# Altium project Optical Digital Interface.PrjPcb
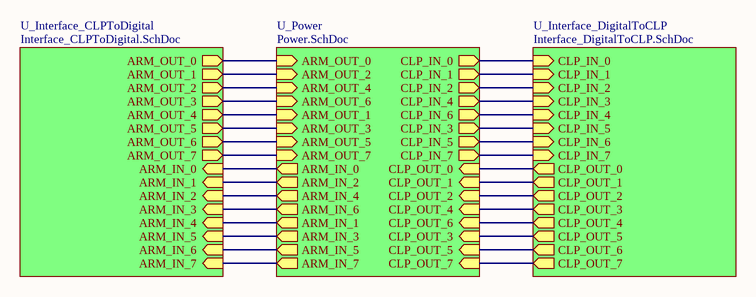
[diagram p0: Interface.SchDoc]
4 sheets, 108 parts. Net scope: hierarchical (ports join the sheet entries above them; power ports are global).
Board file: Interface.PcbDoc
Sheets:
  Interface.SchDoc
    U_Power = Power.SchDoc
    U_Interface_DigitalToCLP = Interface_DigitalToCLP.SchDoc
    U_Interface_CLPToDigital = Interface_CLPToDigital.SchDoc

## Sheet Interface.SchDoc
size A4

### Sub-sheets
U_Interface_CLPToDigital = Interface_CLPToDigital.SchDoc: ARM_IN_0 (in), ARM_IN_1 (in), ARM_IN_2 (in), ARM_IN_3 (in), ARM_IN_4 (in), ARM_IN_5 (in), ARM_IN_6 (in), ARM_IN_7 (in), ARM_OUT_0 (out), ARM_OUT_1 (out), ARM_OUT_2 (out), ARM_OUT_3 (out), ARM_OUT_4 (out), ARM_OUT_5 (out), ARM_OUT_6 (out), ARM_OUT_7 (out)
U_Interface_DigitalToCLP = Interface_DigitalToCLP.SchDoc: CLP_IN_0 (in), CLP_OUT_0 (out), CLP_IN_1 (in), CLP_OUT_1 (out), CLP_IN_2 (in), CLP_OUT_2 (out), CLP_IN_3 (in), CLP_OUT_3 (out), CLP_IN_4 (in), CLP_OUT_4 (out), CLP_IN_5 (in), CLP_OUT_5 (out), CLP_IN_6 (in), CLP_OUT_6 (out), CLP_IN_7 (in), CLP_OUT_7 (out)
U_Power = Power.SchDoc: CLP_IN_0 (out), CLP_IN_1 (out), CLP_IN_2 (out), CLP_IN_4 (out), CLP_IN_6 (out), CLP_IN_3 (out), CLP_IN_5 (out), CLP_IN_7 (out), CLP_OUT_0 (in), CLP_OUT_1 (in), CLP_OUT_2 (in), CLP_OUT_4 (in), CLP_OUT_6 (in), CLP_OUT_3 (in), CLP_OUT_5 (in), CLP_OUT_7 (in), ARM_IN_0 (out), ARM_OUT_0 (in), ARM_OUT_2 (in), ARM_OUT_4 (in), ARM_OUT_6 (in), ARM_OUT_1 (in), ARM_OUT_3 (in), ARM_OUT_5 (in), ARM_OUT_7 (in), ARM_IN_2 (out), ARM_IN_4 (out), ARM_IN_6 (out), ARM_IN_1 (out), ARM_IN_3 (out), ARM_IN_5 (out), ARM_IN_7 (out)

### Nets
NetCN1_1: sheet U_Power/CLP_IN_0, sheet U_Interface_DigitalToCLP/CLP_IN_0
NetCN1_2: sheet U_Power/CLP_IN_1, sheet U_Interface_DigitalToCLP/CLP_IN_1
NetCN1_3: sheet U_Power/CLP_IN_2, sheet U_Interface_DigitalToCLP/CLP_IN_2
NetCN1_4: sheet U_Power/CLP_IN_3, sheet U_Interface_DigitalToCLP/CLP_IN_5
NetCN1_5: sheet U_Power/CLP_IN_4, sheet U_Interface_DigitalToCLP/CLP_IN_3
NetCN1_6: sheet U_Power/CLP_IN_5, sheet U_Interface_DigitalToCLP/CLP_IN_6
NetCN1_7: sheet U_Power/CLP_IN_6, sheet U_Interface_DigitalToCLP/CLP_IN_4
NetCN1_8: sheet U_Power/CLP_IN_7, sheet U_Interface_DigitalToCLP/CLP_IN_7
NetCN3_1: sheet U_Power/ARM_OUT_0, sheet U_Interface_CLPToDigital/ARM_OUT_0
NetCN3_2: sheet U_Power/ARM_OUT_1, sheet U_Interface_CLPToDigital/ARM_OUT_4
NetCN3_3: sheet U_Power/ARM_OUT_2, sheet U_Interface_CLPToDigital/ARM_OUT_1
NetCN3_4: sheet U_Power/ARM_OUT_3, sheet U_Interface_CLPToDigital/ARM_OUT_5
NetCN3_5: sheet U_Power/ARM_OUT_4, sheet U_Interface_CLPToDigital/ARM_OUT_2
NetCN3_6: sheet U_Power/ARM_OUT_5, sheet U_Interface_CLPToDigital/ARM_OUT_6
NetCN3_7: sheet U_Power/ARM_OUT_6, sheet U_Interface_CLPToDigital/ARM_OUT_3
NetCN3_8: sheet U_Power/ARM_OUT_7, sheet U_Interface_CLPToDigital/ARM_OUT_7
NetCN4_1: sheet U_Power/CLP_OUT_0, sheet U_Interface_DigitalToCLP/CLP_OUT_0
NetCN4_2: sheet U_Power/CLP_OUT_1, sheet U_Interface_DigitalToCLP/CLP_OUT_1
NetCN4_3: sheet U_Power/CLP_OUT_2, sheet U_Interface_DigitalToCLP/CLP_OUT_2
NetCN4_4: sheet U_Power/CLP_OUT_3, sheet U_Interface_DigitalToCLP/CLP_OUT_5
NetCN4_5: sheet U_Power/CLP_OUT_4, sheet U_Interface_DigitalToCLP/CLP_OUT_3
NetCN4_6: sheet U_Power/CLP_OUT_5, sheet U_Interface_DigitalToCLP/CLP_OUT_6
NetCN4_7: sheet U_Power/CLP_OUT_6, sheet U_Interface_DigitalToCLP/CLP_OUT_4
NetCN4_8: sheet U_Power/CLP_OUT_7, sheet U_Interface_DigitalToCLP/CLP_OUT_7
NetCN6_1: sheet U_Power/ARM_IN_0, sheet U_Interface_CLPToDigital/ARM_IN_0
NetCN6_2: sheet U_Power/ARM_IN_1, sheet U_Interface_CLPToDigital/ARM_IN_4
NetCN6_3: sheet U_Power/ARM_IN_2, sheet U_Interface_CLPToDigital/ARM_IN_1
NetCN6_4: sheet U_Power/ARM_IN_3, sheet U_Interface_CLPToDigital/ARM_IN_5
NetCN6_5: sheet U_Power/ARM_IN_4, sheet U_Interface_CLPToDigital/ARM_IN_2
NetCN6_6: sheet U_Power/ARM_IN_5, sheet U_Interface_CLPToDigital/ARM_IN_6
NetCN6_7: sheet U_Power/ARM_IN_6, sheet U_Interface_CLPToDigital/ARM_IN_3
NetCN6_8: sheet U_Power/ARM_IN_7, sheet U_Interface_CLPToDigital/ARM_IN_7

## Sheet Power.SchDoc
size A4
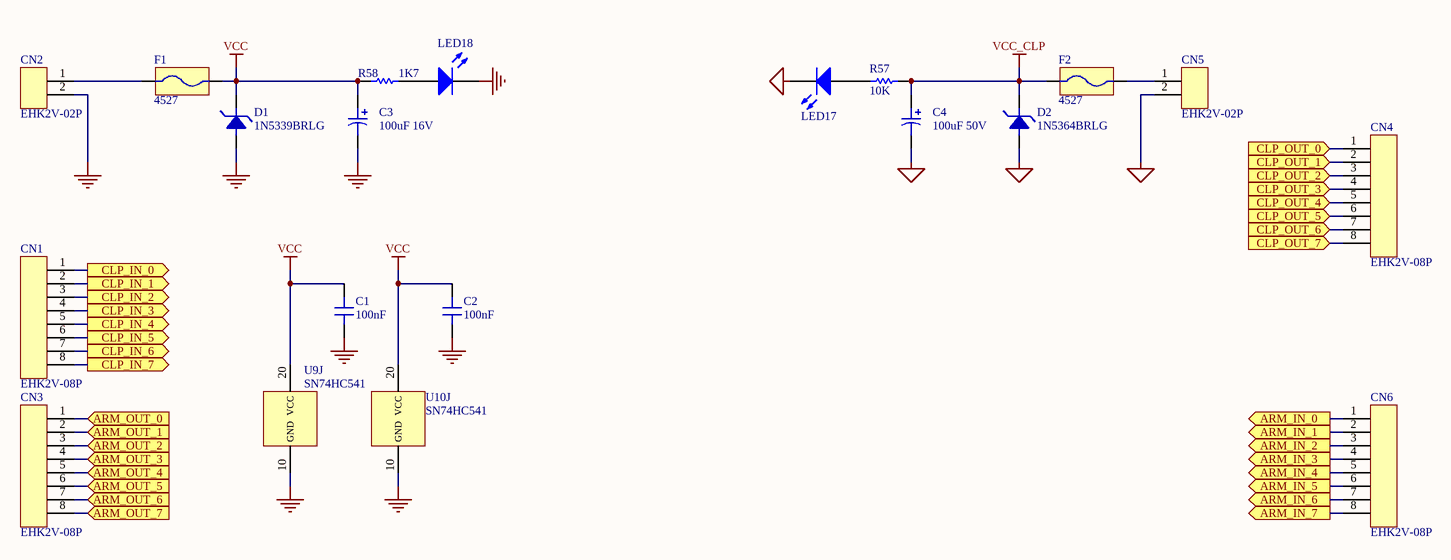
[diagram p1: Power.SchDoc]

### Parts
C1  100nF  [DiskCapacitor]
C2  100nF  [DiskCapacitor]
C3  100uF 16V  [ECA 5x11]
C4  100uF 50V  [ECA 8x11.5]
CN1  EHK2V-08P  [EHK2V-08P]
CN2  EHK2V-02P  [EHK2V-02P]
CN3  EHK2V-08P  [EHK2V-08P]
CN4  EHK2V-08P  [EHK2V-08P]
CN5  EHK2V-02P  [EHK2V-02P]
CN6  EHK2V-08P  [EHK2V-08P]
D1  1N5339BRLG  [DO-15]
D2  1N5364BRLG  [DO-15]
F1  4527  [4527]
F2  4527  [4527]
LED17  151053YS04500  [Type 5mm]  (value not drawn)
LED18  151053YS04500  [Type 5mm]  (value not drawn)
R57  value 10K  [AXIAL-0.3]  (hidden comment: Res1)
R58  value 1K7  [AXIAL-0.3]  (hidden comment: Res1)
U9  SN74HC541  [PDIP20]  (part J of 10)
U10  SN74HC541  [PDIP20]  (part J of 10)

### Ports
ARM_IN_0 (out), ARM_IN_1 (out), ARM_IN_2 (out), ARM_IN_3 (out), ARM_IN_4 (out), ARM_IN_5 (out), ARM_IN_6 (out), ARM_IN_7 (out), ARM_OUT_0 (in), ARM_OUT_1 (in), ARM_OUT_2 (in), ARM_OUT_3 (in), ARM_OUT_4 (in), ARM_OUT_5 (in), ARM_OUT_6 (in), ARM_OUT_7 (in), CLP_IN_0 (out), CLP_IN_1 (out), CLP_IN_2 (out), CLP_IN_3 (out), CLP_IN_4 (out), CLP_IN_5 (out), CLP_IN_6 (out), CLP_IN_7 (out), CLP_OUT_0 (in), CLP_OUT_1 (in), CLP_OUT_2 (in), CLP_OUT_3 (in), CLP_OUT_4 (in), CLP_OUT_5 (in), CLP_OUT_6 (in), CLP_OUT_7 (in)

### Nets
CLP_GND: C4.2 CN5.2 D2.2 LED17.1(K)
GND: C1.1 C2.1 C3.2 CN2.2 D1.2 LED18.1(K) U9.10(GND) U10.10(GND)
VCC: C1.2 C2.2 C3.1 D1.1 F1.2 R58.2 U9.20(VCC) U10.20(VCC)
VCC_CLP: C4.1 D2.1 F2.1 R57.2
NetCN1_1: CN1.1 ; port CLP_IN_0
NetCN1_2: CN1.2 ; port CLP_IN_1
NetCN1_3: CN1.3 ; port CLP_IN_2
NetCN1_4: CN1.4 ; port CLP_IN_3
NetCN1_5: CN1.5 ; port CLP_IN_4
NetCN1_6: CN1.6 ; port CLP_IN_5
NetCN1_7: CN1.7 ; port CLP_IN_6
NetCN1_8: CN1.8 ; port CLP_IN_7
NetCN2_1: CN2.1 F1.1
NetCN3_1: CN3.1 ; port ARM_OUT_0
NetCN3_2: CN3.2 ; port ARM_OUT_1
NetCN3_3: CN3.3 ; port ARM_OUT_2
NetCN3_4: CN3.4 ; port ARM_OUT_3
NetCN3_5: CN3.5 ; port ARM_OUT_4
NetCN3_6: CN3.6 ; port ARM_OUT_5
NetCN3_7: CN3.7 ; port ARM_OUT_6
NetCN3_8: CN3.8 ; port ARM_OUT_7
NetCN4_1: CN4.1 ; port CLP_OUT_0
NetCN4_2: CN4.2 ; port CLP_OUT_1
NetCN4_3: CN4.3 ; port CLP_OUT_2
NetCN4_4: CN4.4 ; port CLP_OUT_3
NetCN4_5: CN4.5 ; port CLP_OUT_4
NetCN4_6: CN4.6 ; port CLP_OUT_5
NetCN4_7: CN4.7 ; port CLP_OUT_6
NetCN4_8: CN4.8 ; port CLP_OUT_7
NetCN5_1: CN5.1 F2.2
NetCN6_1: CN6.1 ; port ARM_IN_0
NetCN6_2: CN6.2 ; port ARM_IN_1
NetCN6_3: CN6.3 ; port ARM_IN_2
NetCN6_4: CN6.4 ; port ARM_IN_3
NetCN6_5: CN6.5 ; port ARM_IN_4
NetCN6_6: CN6.6 ; port ARM_IN_5
NetCN6_7: CN6.7 ; port ARM_IN_6
NetCN6_8: CN6.8 ; port ARM_IN_7
NetLED17_2: LED17.2(A) R57.1
NetLED18_2: LED18.2(A) R58.1

### Library data of the parts
C1 C2 = Capacitor
C3 = ECA1CM101
C4 = ECA1HM101
CN1 CN3 CN4 CN6 = EHK2V-08P: PCB Terminal Blocks
CN2 CN5 = EHK2V-02P: PCB Terminal Blocks
D1 = Diode Zener: 5V6 @ 5W
D2 = Diode Zener: 33V @ 5W
F1 F2 = 4527: 5mm PC FUSE HOLDER
LED17 LED18 = CMP-1477-00001-1: THT LED round mono-color waterclear, WL-TMRW, Yellow; Manufacturer: Wuerth Elektronik; ComponentLink2URL: http://katalog.we-online.de/pbs/datasheet/7448042001.pdfhttp://katalog.we-online.de/pbs/datasheet/7448042001.pdfhttp://katalog.we-online.de/pbs/datasheet/7448042001.pdfhttp://katalog.we-online.de/pbs/datasheet/151053YS04500.pdf; Emitting color: Yellow; PackageReference: Type 5mm; ComponentLink1URL: http://www.we-online.com; PartNumber: 151053YS04500; ComponentLink2Description: Datasheet; ComponentLink1Description: Manufacturer URL
R57 R58 = Res1: Resistor; Published: 8-Jun-2000; LatestRevisionDate: 17-Jul-2002; LatestRevisionNote: Re-released for DXP Platform.; PackageReference: AXIAL-0.3; Publisher: Altium Limited; PackageDescription: Axial Device, Thru-Hole; 2 Leads; 0.3 in Pin Spacing
U9 U10 = SN74HC541: Octal Buffers and Line Drivers With 3-State Outputs

## Sheet Interface_DigitalToCLP.SchDoc
size A4
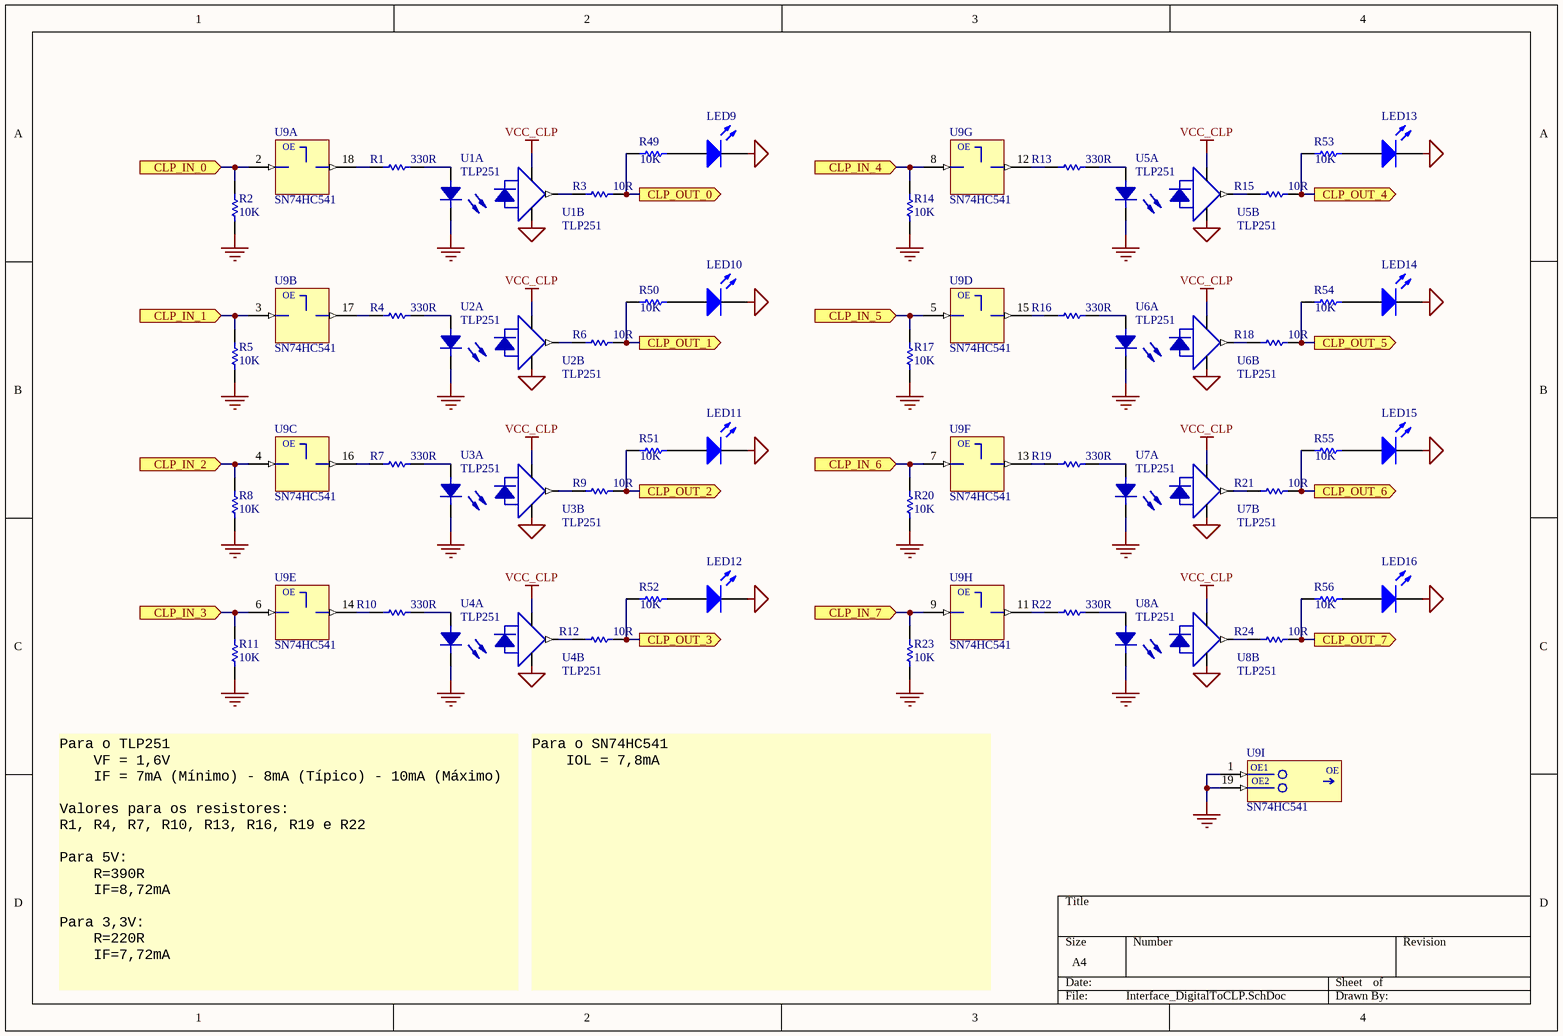
[diagram p2: Interface_DigitalToCLP.SchDoc]

### Parts
LED9  151053YS04500  [Type 5mm]  (value not drawn)
LED10  151053YS04500  [Type 5mm]  (value not drawn)
LED11  151053YS04500  [Type 5mm]  (value not drawn)
LED12  151053YS04500  [Type 5mm]  (value not drawn)
LED13  151053YS04500  [Type 5mm]  (value not drawn)
LED14  151053YS04500  [Type 5mm]  (value not drawn)
LED15  151053YS04500  [Type 5mm]  (value not drawn)
LED16  151053YS04500  [Type 5mm]  (value not drawn)
R1  330R  [CR25]
R2  10K  [CR25]
R3  10R  [CR25]
R4  330R  [CR25]
R5  10K  [CR25]
R6  10R  [CR25]
R7  330R  [CR25]
R8  10K  [CR25]
R9  10R  [CR25]
R10  330R  [CR25]
R11  10K  [CR25]
R12  10R  [CR25]
R13  330R  [CR25]
R14  10K  [CR25]
R15  10R  [CR25]
R16  330R  [CR25]
R17  10K  [CR25]
R18  10R  [CR25]
R19  330R  [CR25]
R20  10K  [CR25]
R21  10R  [CR25]
R22  330R  [CR25]
R23  10K  [CR25]
R24  10R  [CR25]
R49  value 10K  [AXIAL-0.3]  (hidden comment: Res1)
R50  value 10K  [AXIAL-0.3]  (hidden comment: Res1)
R51  value 10K  [AXIAL-0.3]  (hidden comment: Res1)
R52  value 10K  [AXIAL-0.3]  (hidden comment: Res1)
R53  value 10K  [AXIAL-0.3]  (hidden comment: Res1)
R54  value 10K  [AXIAL-0.3]  (hidden comment: Res1)
R55  value 10K  [AXIAL-0.3]  (hidden comment: Res1)
R56  value 10K  [AXIAL-0.3]  (hidden comment: Res1)
U1  TLP251  [DIP8]  (parts A,B of 2)
U2  TLP251  [DIP8]  (parts A,B of 2)
U3  TLP251  [DIP8]  (parts A,B of 2)
U4  TLP251  [DIP8]  (parts A,B of 2)
U5  TLP251  [DIP8]  (parts A,B of 2)
U6  TLP251  [DIP8]  (parts A,B of 2)
U7  TLP251  [DIP8]  (parts A,B of 2)
U8  TLP251  [DIP8]  (parts A,B of 2)
U9  SN74HC541  [PDIP20]  (parts A,B,C,D,E,F,G,H,I of 10)

### Ports
CLP_IN_0 (in), CLP_IN_1 (in), CLP_IN_2 (in), CLP_IN_3 (in), CLP_IN_4 (in), CLP_IN_5 (in), CLP_IN_6 (in), CLP_IN_7 (in), CLP_OUT_0 (out), CLP_OUT_1 (out), CLP_OUT_2 (out), CLP_OUT_3 (out), CLP_OUT_4 (out), CLP_OUT_5 (out), CLP_OUT_6 (out), CLP_OUT_7 (out)

### Nets
CLP_GND: LED9.1(K) LED10.1(K) LED11.1(K) LED12.1(K) LED13.1(K) LED14.1(K) LED15.1(K) LED16.1(K) U1.5 U2.5 U3.5 U4.5 U5.5 U6.5 U7.5 U8.5
GND: R2.1 R5.1 R8.1 R11.1 R14.1 R17.1 R20.1 R23.1 U1.3 U2.3 U3.3 U4.3 U5.3 U6.3 U7.3 U8.3 U9.1(OE1) U9.19(OE2)
VCC_CLP: U1.8 U2.8 U3.8 U4.8 U5.8 U6.8 U7.8 U8.8
NetCN1_1: R2.2 U9.2(A1) ; port CLP_IN_0
NetCN1_2: R5.2 U9.3(A2) ; port CLP_IN_1
NetCN1_3: R8.2 U9.4(A3) ; port CLP_IN_2
NetCN1_4: R17.2 U9.5(A4) ; port CLP_IN_5
NetCN1_5: R11.2 U9.6(A5) ; port CLP_IN_3
NetCN1_6: R20.2 U9.7(A6) ; port CLP_IN_6
NetCN1_7: R14.2 U9.8(A7) ; port CLP_IN_4
NetCN1_8: R23.2 U9.9(A8) ; port CLP_IN_7
NetCN4_1: R3.2 R49.2 ; port CLP_OUT_0
NetCN4_2: R6.2 R50.2 ; port CLP_OUT_1
NetCN4_3: R9.2 R51.2 ; port CLP_OUT_2
NetCN4_4: R18.2 R54.2 ; port CLP_OUT_5
NetCN4_5: R12.2 R52.2 ; port CLP_OUT_3
NetCN4_6: R21.2 R55.2 ; port CLP_OUT_6
NetCN4_7: R15.2 R53.2 ; port CLP_OUT_4
NetCN4_8: R24.2 R56.2 ; port CLP_OUT_7
NetLED9_2: LED9.2(A) R49.1
NetLED10_2: LED10.2(A) R50.1
NetLED11_2: LED11.2(A) R51.1
NetLED12_2: LED12.2(A) R52.1
NetLED13_2: LED13.2(A) R53.1
NetLED14_2: LED14.2(A) R54.1
NetLED15_2: LED15.2(A) R55.1
NetLED16_2: LED16.2(A) R56.1
NetR1_1: R1.1 U9.18(Y1)
NetR1_2: R1.2 U1.2
NetR3_1: R3.1 U1.6
NetR4_1: R4.1 U9.17(Y2)
NetR4_2: R4.2 U2.2
NetR6_1: R6.1 U2.6
NetR7_1: R7.1 U9.16(Y3)
NetR7_2: R7.2 U3.2
NetR9_1: R9.1 U3.6
NetR10_1: R10.1 U9.14(Y5)
NetR10_2: R10.2 U4.2
NetR12_1: R12.1 U4.6
NetR13_1: R13.1 U9.12(Y7)
NetR13_2: R13.2 U5.2
NetR15_1: R15.1 U5.6
NetR16_1: R16.1 U9.15(Y4)
NetR16_2: R16.2 U6.2
NetR18_1: R18.1 U6.6
NetR19_1: R19.1 U9.13(Y6)
NetR19_2: R19.2 U7.2
NetR21_1: R21.1 U7.6
NetR22_1: R22.1 U9.11(Y8)
NetR22_2: R22.2 U8.2
NetR24_1: R24.1 U8.6

### Notes on the sheet
- Para o TLP251
  VF = 1,6V
  IF = 7mA (Mínimo) - 8mA (Típico) - 10mA (Máximo)
  Valores para os resistores:
  R1, R4, R7, R10, R13, R16, R19 e R22
  Para 5V:
  R=390R
  IF=8,72mA
  Para 3,3V:
  R=220R
  IF=7,72mA
- Para o SN74HC541
  IOL = 7,8mA
- (in symbol SN74HC541, part A) OE
- (in symbol SN74HC541, part B) OE
- (in symbol SN74HC541, part C) OE
- (in symbol SN74HC541, part D) OE
- (in symbol SN74HC541, part E) OE
- (in symbol SN74HC541, part F) OE
- (in symbol SN74HC541, part G) OE
- (in symbol SN74HC541, part H) OE
- (in symbol SN74HC541, part I) OE

### Library data of the parts
LED9-LED16 = CMP-1477-00001-1: as LED17 on sheet Power; ComponentLink2URL: http://katalog.we-online.de/pbs/datasheet/7448042001.pdfhttp://katalog.we-online.de/pbs/datasheet/7448042001.pdfhttp://katalog.we-online.de/pbs/datasheet/7448042001.pdfhttp://katalog.we-online.de/pbs/datasheet/151053YS04500.pdf; Emitting color: Yellow; PackageReference: Type 5mm; ComponentLink1URL: http://www.we-online.com; PartNumber: 151053YS04500; ComponentLink2Description: Datasheet; ComponentLink1Description: Manufacturer URL
R1-R24 = Resistor
R49-R56 = Res1: Resistor; Published: 8-Jun-2000; LatestRevisionDate: 17-Jul-2002; LatestRevisionNote: Re-released for DXP Platform.; PackageReference: AXIAL-0.3; Publisher: Altium Limited; PackageDescription: Axial Device, Thru-Hole; 2 Leads; 0.3 in Pin Spacing
U1-U8 = TLP251: Photocoupler
U9 = SN74HC541: as U9 on sheet Power

## Sheet Interface_CLPToDigital.SchDoc
size A4
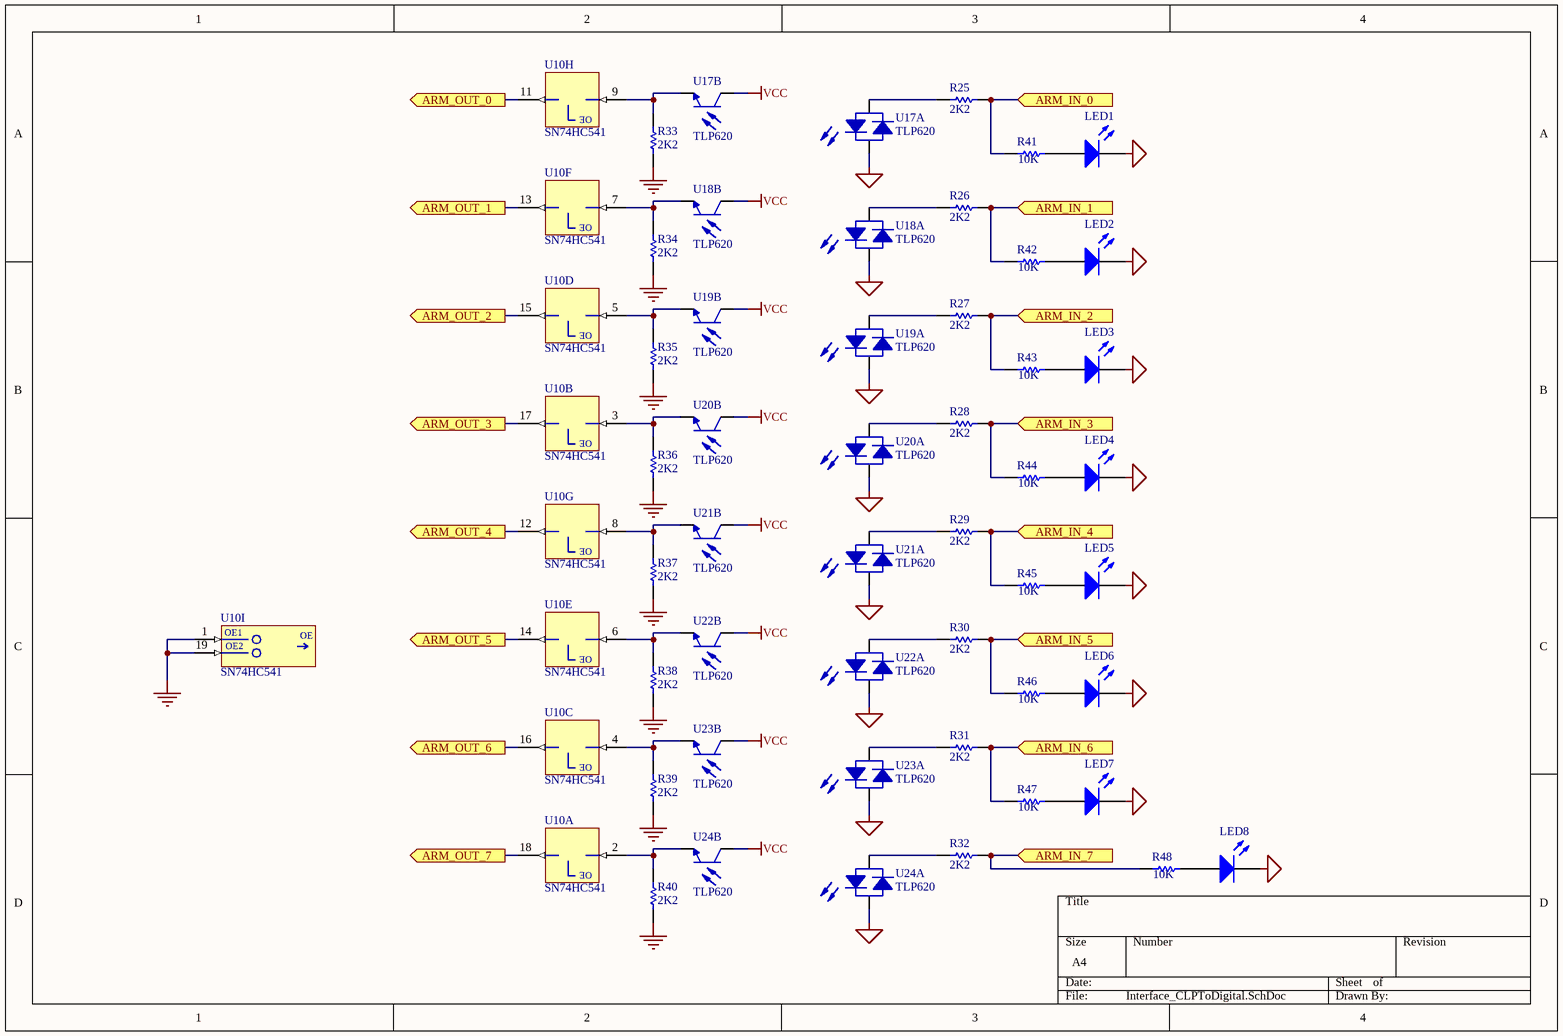
[diagram p3: Interface_CLPToDigital.SchDoc]

### Parts
LED1  151053YS04500  [Type 5mm]  (value not drawn)
LED2  151053YS04500  [Type 5mm]  (value not drawn)
LED3  151053YS04500  [Type 5mm]  (value not drawn)
LED4  151053YS04500  [Type 5mm]  (value not drawn)
LED5  151053YS04500  [Type 5mm]  (value not drawn)
LED6  151053YS04500  [Type 5mm]  (value not drawn)
LED7  151053YS04500  [Type 5mm]  (value not drawn)
LED8  151053YS04500  [Type 5mm]  (value not drawn)
R25  2K2  [CR25]
R26  2K2  [CR25]
R27  2K2  [CR25]
R28  2K2  [CR25]
R29  2K2  [CR25]
R30  2K2  [CR25]
R31  2K2  [CR25]
R32  2K2  [CR25]
R33  2K2  [CR25]
R34  2K2  [CR25]
R35  2K2  [CR25]
R36  2K2  [CR25]
R37  2K2  [CR25]
R38  2K2  [CR25]
R39  2K2  [CR25]
R40  2K2  [CR25]
R41  value 10K  [AXIAL-0.5]  (hidden comment: 1)
R42  value 10K  [AXIAL-0.5]  (hidden comment: Res1)
R43  value 10K  [AXIAL-0.5]  (hidden comment: Res1)
R44  value 10K  [AXIAL-0.5]  (hidden comment: Res1)
R45  value 10K  [AXIAL-0.5]  (hidden comment: Res1)
R46  value 10K  [AXIAL-0.5]  (hidden comment: Res1)
R47  value 10K  [AXIAL-0.5]  (hidden comment: Res1)
R48  value 10K  [AXIAL-0.3]  (hidden comment: Res1)
U10  SN74HC541  [PDIP20]  (parts A,B,C,D,E,F,G,H,I of 10)
U17  TLP620  [DIP4]  (parts A,B of 2)
U18  TLP620  [DIP4]  (parts A,B of 2)
U19  TLP620  [DIP4]  (parts A,B of 2)
U20  TLP620  [DIP4]  (parts A,B of 2)
U21  TLP620  [DIP4]  (parts A,B of 2)
U22  TLP620  [DIP4]  (parts A,B of 2)
U23  TLP620  [DIP4]  (parts A,B of 2)
U24  TLP620  [DIP4]  (parts A,B of 2)

### Ports
ARM_IN_0 (in), ARM_IN_1 (in), ARM_IN_2 (in), ARM_IN_3 (in), ARM_IN_4 (in), ARM_IN_5 (in), ARM_IN_6 (in), ARM_IN_7 (in), ARM_OUT_0 (out), ARM_OUT_1 (out), ARM_OUT_2 (out), ARM_OUT_3 (out), ARM_OUT_4 (out), ARM_OUT_5 (out), ARM_OUT_6 (out), ARM_OUT_7 (out)

### Nets
CLP_GND: LED1.1(K) LED2.1(K) LED3.1(K) LED4.1(K) LED5.1(K) LED6.1(K) LED7.1(K) LED8.1(K) U17.2 U18.2 U19.2 U20.2 U21.2 U22.2 U23.2 U24.2
GND: R33.1 R34.1 R35.2 R36.1 R37.1 R38.1 R39.1 R40.1 U10.1(OE1) U10.19(OE2)
VCC: U17.4 U18.4 U19.4 U20.4 U21.4 U22.4 U23.4 U24.4
NetCN3_1: U10.11(Y8) ; port ARM_OUT_0
NetCN3_2: U10.12(Y7) ; port ARM_OUT_4
NetCN3_3: U10.13(Y6) ; port ARM_OUT_1
NetCN3_4: U10.14(Y5) ; port ARM_OUT_5
NetCN3_5: U10.15(Y4) ; port ARM_OUT_2
NetCN3_6: U10.16(Y3) ; port ARM_OUT_6
NetCN3_7: U10.17(Y2) ; port ARM_OUT_3
NetCN3_8: U10.18(Y1) ; port ARM_OUT_7
NetCN6_1: R25.2 R41.2 ; port ARM_IN_0
NetCN6_2: R29.2 R45.2 ; port ARM_IN_4
NetCN6_3: R26.2 R42.2 ; port ARM_IN_1
NetCN6_4: R30.2 R46.2 ; port ARM_IN_5
NetCN6_5: R27.2 R43.2 ; port ARM_IN_2
NetCN6_6: R31.2 R47.2 ; port ARM_IN_6
NetCN6_7: R28.2 R44.2 ; port ARM_IN_3
NetCN6_8: R32.2 R48.2 ; port ARM_IN_7
NetLED1_2: LED1.2(A) R41.1
NetLED2_2: LED2.2(A) R42.1
NetLED3_2: LED3.2(A) R43.1
NetLED4_2: LED4.2(A) R44.1
NetLED5_2: LED5.2(A) R45.1
NetLED6_2: LED6.2(A) R46.1
NetLED7_2: LED7.2(A) R47.1
NetLED8_2: LED8.2(A) R48.1
NetR25_1: R25.1 U17.1
NetR26_1: R26.1 U18.1
NetR27_1: R27.1 U19.1
NetR28_1: R28.1 U20.1
NetR29_1: R29.1 U21.1
NetR30_1: R30.1 U22.1
NetR31_1: R31.1 U23.1
NetR32_1: R32.1 U24.1
NetR33_2: R33.2 U10.9(A8) U17.3
NetR34_2: R34.2 U10.7(A6) U18.3
NetR35_1: R35.1 U10.5(A4) U19.3
NetR36_2: R36.2 U10.3(A2) U20.3
NetR37_2: R37.2 U10.8(A7) U21.3
NetR38_2: R38.2 U10.6(A5) U22.3
NetR39_2: R39.2 U10.4(A3) U23.3
NetR40_2: R40.2 U10.2(A1) U24.3

### Notes on the sheet
- (in symbol SN74HC541, part A) OE
- (in symbol SN74HC541, part B) OE
- (in symbol SN74HC541, part C) OE
- (in symbol SN74HC541, part D) OE
- (in symbol SN74HC541, part E) OE
- (in symbol SN74HC541, part F) OE
- (in symbol SN74HC541, part G) OE
- (in symbol SN74HC541, part H) OE
- (in symbol SN74HC541, part I) OE

### Library data of the parts
LED1-LED8 = CMP-1477-00001-1: as LED17 on sheet Power; ComponentLink2URL: http://katalog.we-online.de/pbs/datasheet/7448042001.pdfhttp://katalog.we-online.de/pbs/datasheet/7448042001.pdfhttp://katalog.we-online.de/pbs/datasheet/7448042001.pdfhttp://katalog.we-online.de/pbs/datasheet/151053YS04500.pdf; Emitting color: Yellow; PackageReference: Type 5mm; ComponentLink1URL: http://www.we-online.com; PartNumber: 151053YS04500; ComponentLink2Description: Datasheet; ComponentLink1Description: Manufacturer URL
R25-R40 = Resistor
R41-R48 = Res1: Resistor; Published: 8-Jun-2000; LatestRevisionDate: 17-Jul-2002; LatestRevisionNote: Re-released for DXP Platform.; PackageReference: AXIAL-0.3; Publisher: Altium Limited; PackageDescription: Axial Device, Thru-Hole; 2 Leads; 0.3 in Pin Spacing
U10 = SN74HC541: as U9 on sheet Power
U17-U24 = TLP620: TOSHIBA Photocoupler

## Nets that join several sheets
CLP_GND: Power (C4.2 CN5.2 D2.2 LED17.1), Interface_DigitalToCLP (16 pins), Interface_CLPToDigital (16 pins)
GND: Power (8 pins), Interface_DigitalToCLP (18 pins), Interface_CLPToDigital (10 pins)
VCC: Power (8 pins), Interface_CLPToDigital (8 pins)
VCC_CLP: Power (C4.1 D2.1 F2.1 R57.2), Interface_DigitalToCLP (8 pins)
NetCN1_1: Power (CN1.1), Interface_DigitalToCLP (R2.2 U9.2)
NetCN1_2: Power (CN1.2), Interface_DigitalToCLP (R5.2 U9.3)
NetCN1_3: Power (CN1.3), Interface_DigitalToCLP (R8.2 U9.4)
NetCN1_4: Power (CN1.4), Interface_DigitalToCLP (R17.2 U9.5)
NetCN1_5: Power (CN1.5), Interface_DigitalToCLP (R11.2 U9.6)
NetCN1_6: Power (CN1.6), Interface_DigitalToCLP (R20.2 U9.7)
NetCN1_7: Power (CN1.7), Interface_DigitalToCLP (R14.2 U9.8)
NetCN1_8: Power (CN1.8), Interface_DigitalToCLP (R23.2 U9.9)
NetCN3_1: Power (CN3.1), Interface_CLPToDigital (U10.11)
NetCN3_2: Power (CN3.2), Interface_CLPToDigital (U10.12)
NetCN3_3: Power (CN3.3), Interface_CLPToDigital (U10.13)
NetCN3_4: Power (CN3.4), Interface_CLPToDigital (U10.14)
NetCN3_5: Power (CN3.5), Interface_CLPToDigital (U10.15)
NetCN3_6: Power (CN3.6), Interface_CLPToDigital (U10.16)
NetCN3_7: Power (CN3.7), Interface_CLPToDigital (U10.17)
NetCN3_8: Power (CN3.8), Interface_CLPToDigital (U10.18)
NetCN4_1: Power (CN4.1), Interface_DigitalToCLP (R3.2 R49.2)
NetCN4_2: Power (CN4.2), Interface_DigitalToCLP (R6.2 R50.2)
NetCN4_3: Power (CN4.3), Interface_DigitalToCLP (R9.2 R51.2)
NetCN4_4: Power (CN4.4), Interface_DigitalToCLP (R18.2 R54.2)
NetCN4_5: Power (CN4.5), Interface_DigitalToCLP (R12.2 R52.2)
NetCN4_6: Power (CN4.6), Interface_DigitalToCLP (R21.2 R55.2)
NetCN4_7: Power (CN4.7), Interface_DigitalToCLP (R15.2 R53.2)
NetCN4_8: Power (CN4.8), Interface_DigitalToCLP (R24.2 R56.2)
NetCN6_1: Power (CN6.1), Interface_CLPToDigital (R25.2 R41.2)
NetCN6_2: Power (CN6.2), Interface_CLPToDigital (R29.2 R45.2)
NetCN6_3: Power (CN6.3), Interface_CLPToDigital (R26.2 R42.2)
NetCN6_4: Power (CN6.4), Interface_CLPToDigital (R30.2 R46.2)
NetCN6_5: Power (CN6.5), Interface_CLPToDigital (R27.2 R43.2)
NetCN6_6: Power (CN6.6), Interface_CLPToDigital (R31.2 R47.2)
NetCN6_7: Power (CN6.7), Interface_CLPToDigital (R28.2 R44.2)
NetCN6_8: Power (CN6.8), Interface_CLPToDigital (R32.2 R48.2)